# Altium schematic sheet L3G4200.SchDoc
size A4; Organization: Altium Limited; Address1: L3, 12a Rodborough Rd; Address2: Frenchs Forest; Address3: NSW; Address4: Australia 2086; SheetNumber: 10; SheetTotal: 10
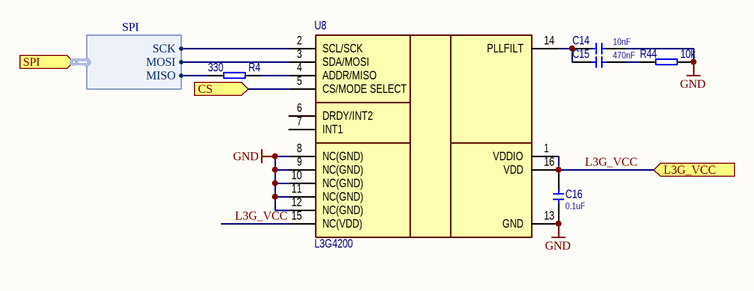
[diagram p0: L3G4200.SchDoc]

## Parts
C14  value 10nF  [CERCAP 0402]
C15  value 470nF  [CERCAP 0402]
C16  value 0.1uF  [CERCAP 0402]
R4  value 330  [RES 0402]
R44  value 10k  [RES 0402]
U8  L3G4200  [LGA16_L3G4200]

## Ports
CS (in), L3G_VCC (in), SPI (in, harness SPI)

## Harnesses
SPI: SCK, MOSI, MISO

## Nets
GND: C14.2 C16.1 R44.2 U8.8(NC(GND)) U8.9(NC(GND)) U8.10(NC(GND)) U8.11(NC(GND)) U8.12(NC(GND)) U8.13(GND)
CS: U8.5(CS/MODE_SELECT) ; port CS
L3G_VCC: C16.2 U8.1(VDDIO) U8.15(NC(VDD)) U8.16(VDD) ; port L3G_VCC
NetC14_1: C14.1 C15.1 U8.14(PLLFILT)
NetC15_2: C15.2 R44.1
NetR4_1: R4.1 ; port SPI.MISO
NetR4_2: R4.2 U8.4(ADDR/MISO)
NetU8_2: U8.2(SCL/SCK) ; port SPI.SCK
NetU8_3: U8.3(SDA/MOSI) ; port SPI.MOSI

Not connected (* = marked no-connect by the designer): U8 6(DRDY/INT2) 7(INT1)

## Notes on the sheet
- Title
- Size:
- Date:
- A4
- Number:
- Time:
- Revision:
- Sheet
- of
- File:

## Library data of the parts
C14-C16 = !Capacitor: Capacitor; IsSMT: NoSMT; Diel: X7R; Voltage: *
R4 R44 = !Resistor: Resistor; IsSMT: NoSMT